# Altium schematic sheet SH4 - LEVEL SHIFTERS.SchDoc: Level Shifters
size B; CheckedBy: Lance Bantoto; DrawnBy: Kyle Hong; Engineer: Kyle Hong; Revision: 2; SheetNumber: 4; SheetTotal: 8
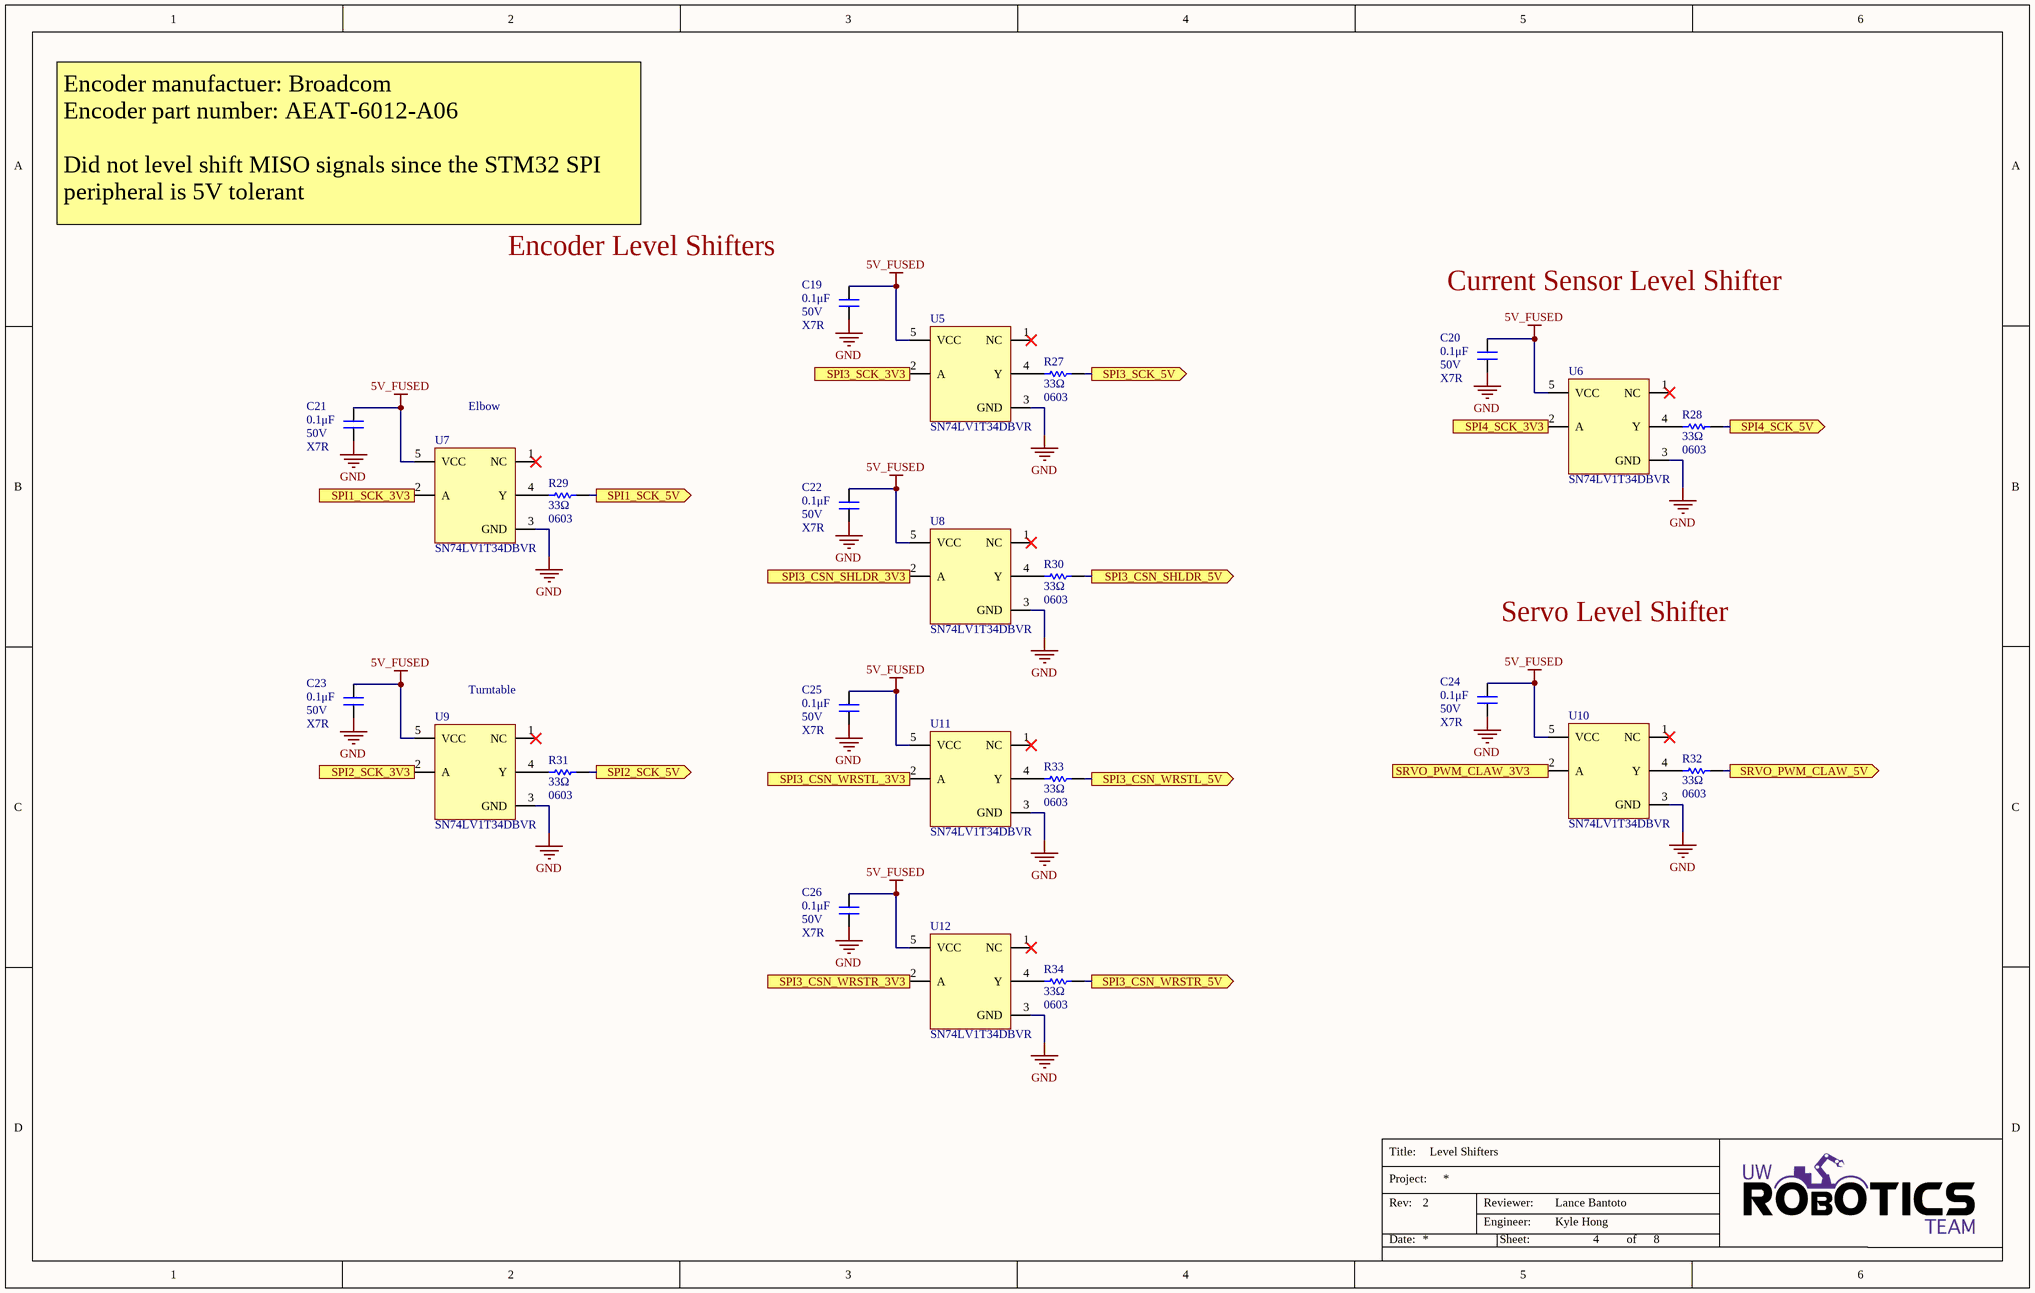
[diagram p0: SH4 - LEVEL SHIFTERS.SchDoc]

## Parts
C19  value 0.1μF  Dielectric: X7R  Voltage Rating: 50V  [CAP0603]  (hidden comment: CAP_0.1uF_50V_0603)
C20  value 0.1μF  Dielectric: X7R  Voltage Rating: 50V  [CAP0603]  (hidden comment: CAP_0.1uF_50V_0603)
C21  value 0.1μF  Dielectric: X7R  Voltage Rating: 50V  [CAP0603]  (hidden comment: CAP_0.1uF_50V_0603)
C22  value 0.1μF  Dielectric: X7R  Voltage Rating: 50V  [CAP0603]  (hidden comment: CAP_0.1uF_50V_0603)
C23  value 0.1μF  Dielectric: X7R  Voltage Rating: 50V  [CAP0603]  (hidden comment: CAP_0.1uF_50V_0603)
C24  value 0.1μF  Dielectric: X7R  Voltage Rating: 50V  [CAP0603]  (hidden comment: CAP_0.1uF_50V_0603)
C25  value 0.1μF  Dielectric: X7R  Voltage Rating: 50V  [CAP0603]  (hidden comment: CAP_0.1uF_50V_0603)
C26  value 0.1μF  Dielectric: X7R  Voltage Rating: 50V  [CAP0603]  (hidden comment: CAP_0.1uF_50V_0603)
R27  Resistance: 33Ω  Package/Footprint: 0603  [RESC0603]  (hidden comment: RES_33Ω_0603_1%)
R28  Resistance: 33Ω  Package/Footprint: 0603  [RESC0603]  (hidden comment: RES_33Ω_0603_1%)
R29  Resistance: 33Ω  Package/Footprint: 0603  [RESC0603]  (hidden comment: RES_33Ω_0603_1%)
R30  Resistance: 33Ω  Package/Footprint: 0603  [RESC0603]  (hidden comment: RES_33Ω_0603_1%)
R31  Resistance: 33Ω  Package/Footprint: 0603  [RESC0603]  (hidden comment: RES_33Ω_0603_1%)
R32  Resistance: 33Ω  Package/Footprint: 0603  [RESC0603]  (hidden comment: RES_33Ω_0603_1%)
R33  Resistance: 33Ω  Package/Footprint: 0603  [RESC0603]  (hidden comment: RES_33Ω_0603_1%)
R34  Resistance: 33Ω  Package/Footprint: 0603  [RESC0603]  (hidden comment: RES_33Ω_0603_1%)
U5  SN74LV1T34  [SN74LV1T34DBVR]  (value not drawn)
U6  SN74LV1T34  [SN74LV1T34DBVR]  (value not drawn)
U7  SN74LV1T34  [SN74LV1T34DBVR]  (value not drawn)
U8  SN74LV1T34  [SN74LV1T34DBVR]  (value not drawn)
U9  SN74LV1T34  [SN74LV1T34DBVR]  (value not drawn)
U10  SN74LV1T34  [SN74LV1T34DBVR]  (value not drawn)
U11  SN74LV1T34  [SN74LV1T34DBVR]  (value not drawn)
U12  SN74LV1T34  [SN74LV1T34DBVR]  (value not drawn)

## Ports
SPI1_SCK_3V3 (in), SPI1_SCK_5V (out), SPI2_SCK_3V3 (in), SPI2_SCK_5V (out), SPI3_CSN_SHLDR_3V3 (in), SPI3_CSN_SHLDR_5V (out), SPI3_CSN_WRSTL_3V3 (in), SPI3_CSN_WRSTL_5V (out), SPI3_CSN_WRSTR_3V3 (in), SPI3_CSN_WRSTR_5V (out), SPI3_SCK_3V3 (in), SPI3_SCK_5V (out), SPI4_SCK_3V3 (in), SPI4_SCK_5V (out), SRVO_PWM_CLAW_3V3 (in), SRVO_PWM_CLAW_5V (out)

## Nets
5V_FUSED: C19.2 C20.2 C21.2 C22.2 C23.2 C24.2 C25.2 C26.2 U5.5(VCC) U6.5(VCC) U7.5(VCC) U8.5(VCC) U9.5(VCC) U10.5(VCC) U11.5(VCC) U12.5(VCC)
GND: C19.1 C20.1 C21.1 C22.1 C23.1 C24.1 C25.1 C26.1 U5.3(GND) U6.3(GND) U7.3(GND) U8.3(GND) U9.3(GND) U10.3(GND) U11.3(GND) U12.3(GND)
SPI1_SCK_3V3: U7.2(A) ; port SPI1_SCK_3V3
SPI1_SCK_5V: R29.2 ; port SPI1_SCK_5V
SPI2_SCK_3V3: U9.2(A) ; port SPI2_SCK_3V3
SPI2_SCK_5V: R31.2 ; port SPI2_SCK_5V
SPI3_CSN_SHLDR_3V3: U8.2(A) ; port SPI3_CSN_SHLDR_3V3
SPI3_CSN_SHLDR_5V: R30.2 ; port SPI3_CSN_SHLDR_5V
SPI3_CSN_WRSTL_3V3: U11.2(A) ; port SPI3_CSN_WRSTL_3V3
SPI3_CSN_WRSTL_5V: R33.2 ; port SPI3_CSN_WRSTL_5V
SPI3_CSN_WRSTR_3V3: U12.2(A) ; port SPI3_CSN_WRSTR_3V3
SPI3_CSN_WRSTR_5V: R34.2 ; port SPI3_CSN_WRSTR_5V
SPI3_SCK_3V3: U5.2(A) ; port SPI3_SCK_3V3
SPI3_SCK_5V: R27.2 ; port SPI3_SCK_5V
SPI4_SCK_3V3: U6.2(A) ; port SPI4_SCK_3V3
SPI4_SCK_5V: R28.2 ; port SPI4_SCK_5V
SRVO_PWM_CLAW_3V3: U10.2(A) ; port SRVO_PWM_CLAW_3V3
SRVO_PWM_CLAW_5V: R32.2 ; port SRVO_PWM_CLAW_5V
NetR27_1: R27.1 U5.4(Y)
NetR28_1: R28.1 U6.4(Y)
NetR29_1: R29.1 U7.4(Y)
NetR30_1: R30.1 U8.4(Y)
NetR31_1: R31.1 U9.4(Y)
NetR32_1: R32.1 U10.4(Y)
NetR33_1: R33.1 U11.4(Y)
NetR34_1: R34.1 U12.4(Y)

Not connected (* = marked no-connect by the designer): U5 1(NC)*; U6 1(NC)*; U7 1(NC)*; U8 1(NC)*; U9 1(NC)*; U10 1(NC)*; U11 1(NC)*; U12 1(NC)*

## Notes on the sheet
- Encoder manufactuer: Broadcom
  Encoder part number: AEAT-6012-A06
  Did not level shift MISO signals since the STM32 SPI peripheral is 5V tolerant
- (near C19) Encoder Level Shifters
- Current Sensor Level Shifter
- (near U7) Elbow
- Servo Level Shifter
- (near U9) Turntable
- Title:
- Project:
- Date:
- Rev:
- Reviewer:
- Engineer:
- Sheet:
- of

## Library data of the parts
C19-C26 = CAP_0.1uF_50V_0603: CAP CER 0.1UF 50V X7R 0603; Manufacturer Part Number 1: CC0603KRX7R9BB104; Manufacturer 1: Yageo; Package/Footprint: 0603; Temperature Coefficient: X7R; Supplier Part Number 1: 311-1344-1-ND; Supplier 1: Digi-Key; Mounting Type: SMD
R27-R34 = RES_33Ω_0603_1%: RES 33 OHM 1% 1/10W 0603; Manufacturer 1: Vishay; Manufacturer Part Number 1: CRCW060333R0FKEA; Rated Power Dissipation (P): 100mW; Temperature Coefficient: 100ppm/°C; Working Voltage: 75V; Rated Temperature: 70°C; Package Height: 0.45mm; Package Length: 1.55mm; Package Width: 0.85mm; Reference Standard: AEC-Q200; Supplier 1: Digi-Key; RoHS: Yes; Category: Chip SMD Resistors; Stock 1: 159291; Pricing 1: 1=0.10000, 10=0.03100, 100=0.01260, 1000=0.00567, 2500=0.00492 (USD); Number of Pins: 2; Terminal Finish: Nickel; Package Shape: Rectangular; Min Operating Temperature: -55°C; Max Operating Temperature: 155°C; JESD-609 Code: e3; Resistor Type: FIXED RESISTOR; Construction: Chip; Package Style: SMTMeter; Packaging: Tape and Reel; Technology: METAL GLAZE/THICK FILM; Termination: Wraparound; Supplier Part Number 1: 541-33.0HCT-ND; Tolerance: 1%; Mounting Type: SMD
U5-U12 = SN74LV1T34: IC BUF NON-INVERT 5.5V SOT23-5; Manufacturer 1: Texas Instruments; Package/Footprint: SOT-23-5; Supplier 1: Digi-Key; Supplier Part Number 1: 296-37176-1-ND; Manufacturer Part Number 1: SN74LV1T34DBVR; Mounting Type: SMD; LCSC Part #: C100024